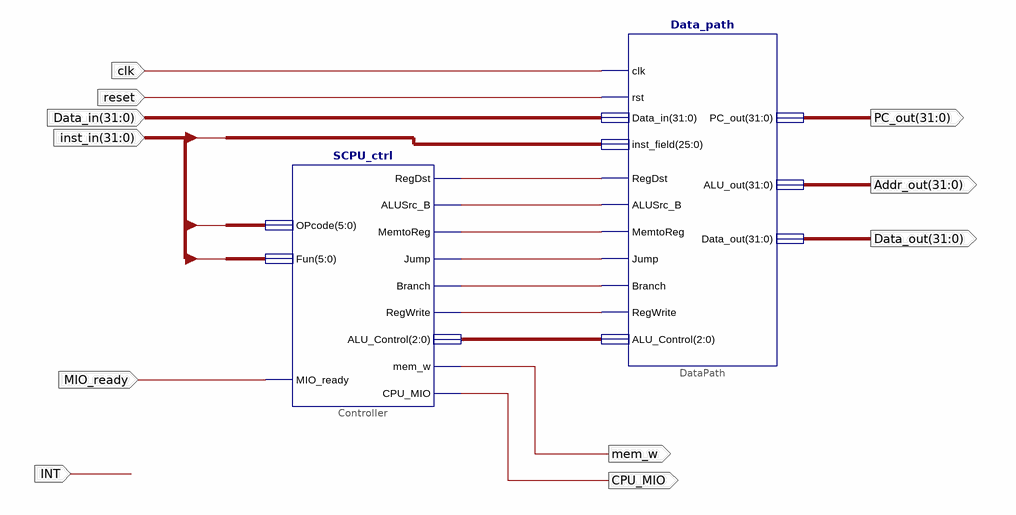
[diagram p0: schematic sheet 1]
// Xilinx ISE schematic SCPU.sch (spartan6) as structural Verilog: 2 symbols, 11 ports
module SCPU (
  input  clk,
  input  reset,
  input  [31:0] Data_in,
  input  [31:0] inst_in,
  input  MIO_ready,
  input  INT,
  output [31:0] PC_out,
  output [31:0] Addr_out,
  output [31:0] Data_out,
  output mem_w,
  output CPU_MIO
);

  wire XLXN_1, XLXN_2, XLXN_3, XLXN_4, XLXN_5, XLXN_6;
  wire [2:0] XLXN_7;

  SCPU_ctrl Controller (
    .RegDst(XLXN_1), .ALUSrc_B(XLXN_2), .MemtoReg(XLXN_3), .Jump(XLXN_4), .Branch(XLXN_5), .RegWrite(XLXN_6),
    .ALU_Control(XLXN_7), .CPU_MIO(CPU_MIO), .mem_w(mem_w), .Fun(inst_in[5:0]), .MIO_ready(MIO_ready),
    .OPcode(inst_in[31:26]));
  Data_path DataPath (
    .RegDst(XLXN_1), .ALUSrc_B(XLXN_2), .MemtoReg(XLXN_3), .Jump(XLXN_4), .Branch(XLXN_5), .RegWrite(XLXN_6),
    .ALU_Control(XLXN_7), .Data_in(Data_in), .inst_field(inst_in[25:0]), .clk(clk), .rst(reset),
    .PC_out(PC_out), .ALU_out(Addr_out), .Data_out(Data_out));
endmodule
